# EAGLE design rcswitch (EAGLE 6.5.0)
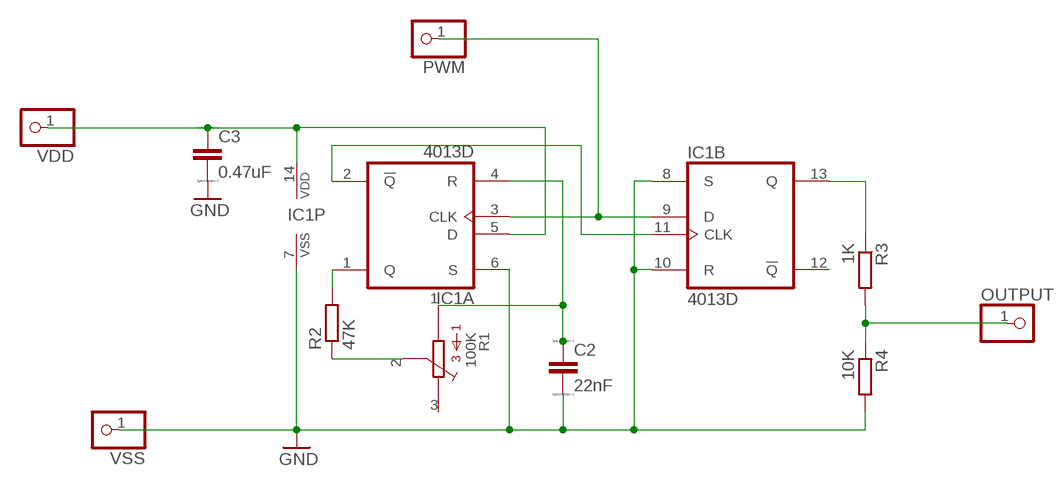
[diagram p0: schematic, sheet 1]

## Parts
C2  22nF  CC3216  [C3216]
C3  0.47uF  CC3216  [C3216]
IC1  4013D  [SO14]
OUTPUT  PINHD-1X1  [1X01]
PWM  PINHD-1X1  [1X01]
R1  100K  3386  [3386-MULTI]
R2  47K  R-EU_R3225  [R3225]
R3  1K  R-EU_R3225  [R3225]
R4  10K  R-EU_R3225  [R3225]
VDD  PINHD-1X1  [1X01]
VSS  PINHD-1X1  [1X01]

## Nets
GND: C2.2 C3.2 IC1.6(A:S) IC1.7(P:VSS) IC1.8(B:S) IC1.10(B:R) R4.2 VSS.1
N$1: IC1.1(A:Q) R2.2
N$2: R1.2 R2.1
N$3: C2.1 IC1.4(A:R) R1.1
N$4: IC1.13(B:Q) R3.1
N$6: IC1.3(A:CLK) IC1.9(B:D) PWM.1
N$8: IC1.2(A:!Q) IC1.11(B:CLK)
N$9: C3.1 IC1.5(A:D) IC1.14(P:VDD) VDD.1
OUTPUT: OUTPUT.1 R3.2 R4.1
Unconnected: IC1.12(B:!Q) R1.3 R1.4 R1.5 R1.6

## Library data of the parts
C2 C3 = eagle-ltspice:C: CAPACITOR, European symbol; SPICEMODEL: NONE; SPICEPREFIX: C
IC1 = 40xx:4013: Dual D FLIP FLOP, set/reset
OUTPUT PWM VDD VSS = pinhead:PINHD-1X1: PIN HEADER
R1 = bourns:3386: 3386 Series 3/8" Square Trimmer (Multi-Package F,P,K & Y)
R2-R4 = rcl:R-EU_: RESISTOR, European symbol

## Board
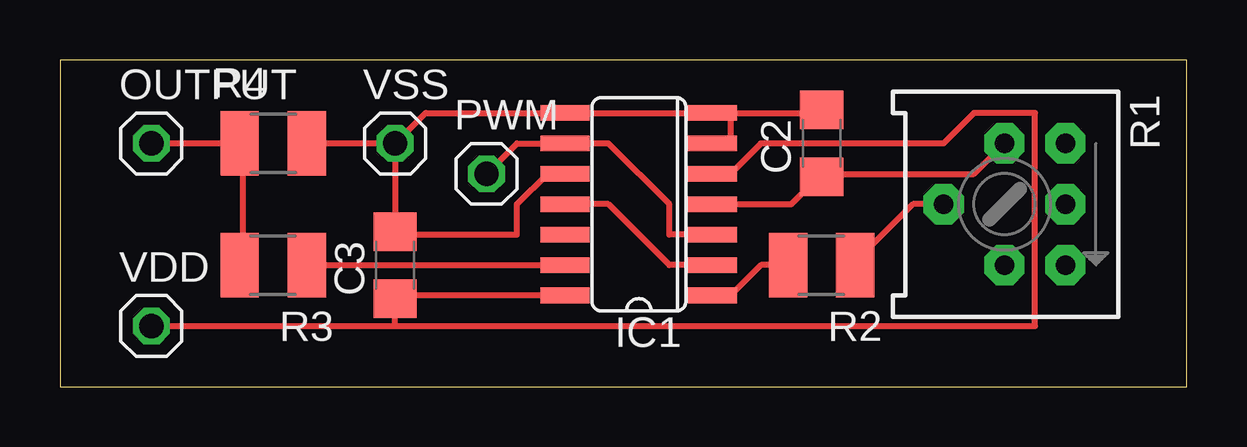
[diagram p1: board, top side]

Size 46.97 x 13.64 mm. Coordinates in mm from the lower left corner, seen from the top.
Outline: 0,0 46.97,0 46.97,13.64 0,13.64 0,0
Copper layers (1*16): Top 0.035mm / dielectric 1.5mm / Bottom 0.035mm
Design rules "rcswitch": minimum track width 10mil, minimum drill 24mil, track to track 0.205mm, track to pad 0.205mm, pad to pad 0.205mm, via to via 0.205mm, smd to smd 8mil, copper to edge 40mil, drill to drill 8mil, minimum pad ring 10mil, minimum via ring 8mil, stop-mask expansion 4mil, vias tented up to drill 0mil, thermal gap 10mil

### Footprints (pad centres in the part's own frame; a part is rotated, then mirrored left to right if it is on the bottom)
C3216 = smd 1.6 x 1.8: 1 -1.4,0; 2 1.4,0
SO14 = smd 0.66 x 2.032: 1 -3.81,-3.073; 2 -2.54,-3.073; 3 -1.27,-3.073; 4 0,-3.073; 5 1.27,-3.073; 6 2.54,-3.073; 7 3.81,-3.073; 8 3.81,3.073; 9 2.54,3.073; 10 1.27,3.073; 11 0,3.073; 12 -1.27,3.073; 13 -2.54,3.073; 14 -3.81,3.073
1X01 = drill 1.016 octagon: 1 0,0
3386-MULTI = drill 0.813 pad 1.676 octagon: 1 -2.54,0; 2 0,-2.54; 3 2.54,0; 4 -2.54,2.54; 5 0,2.54; 6 2.54,2.54
R3225 = smd 1.6 x 2.7: 1 -1.4,0; 2 1.4,0

### Placement (x,y rotation side)
C2  31.75,10.16 90 top
C3  13.97,5.08 90 top
IC1  24.13,7.62 90 top
OUTPUT  3.81,10.16 0 top
PWM  17.78,8.89 0 top
R1  39.37,7.62 270 top
R2  31.75,5.08 180 top
R3  8.89,5.08 180 top
R4  8.89,10.16 0 top
VDD  3.81,2.54 0 top
VSS  13.97,10.16 0 top

### Tracks (layer width: path | path; a pad name or v marks a point on that pad's centre or on a via)
GND
  Top 0.254: 27.94,11.43 31.75,11.43 C2.2 | 27.94,11.43 27.94,10.16 IC1.6 | 27.94,11.43 IC1.7 IC1.8 15.24,11.43 VSS.1 | VSS.1 R4.2 | VSS.1 C3.2 13.97,6.35 19.05,6.35 19.05,7.62 20.32,8.89 IC1.10
N$1
  Top 0.254: IC1.1 27.94,3.81 29.21,5.08 R2.2 30.48,5.08
N$2
  Top 0.254: R1.2 35.56,7.62 33.02,5.08 R2.1
N$3
  Top 0.254: 31.75,8.89 30.48,7.62 IC1.4 | R1.1 38.1,8.89 31.75,8.89 | 31.75,8.89 C2.1
N$4
  Top 0.254: IC1.13 R3.1 10.16,5.08
N$6
  Top 0.254: IC1.3 25.4,6.35 25.4,7.62 22.86,10.16 IC1.9 19.05,10.16 PWM.1
N$8
  Top 0.254: IC1.11 22.86,7.62 25.4,5.08 IC1.2
N$9
  Top 0.254: IC1.14 13.97,3.81 C3.1 13.97,2.54 | VDD.1 13.97,2.54 | 13.97,2.54 40.64,2.54 40.64,11.43 38.1,11.43 36.83,10.16 29.21,10.16 27.94,8.89 IC1.5
OUTPUT
  Top 0.254: OUTPUT.1 R4.1 7.62,10.16 7.62,5.08 R3.2